# EAGLE design BiphasicBoard (EAGLE 6.5.0)
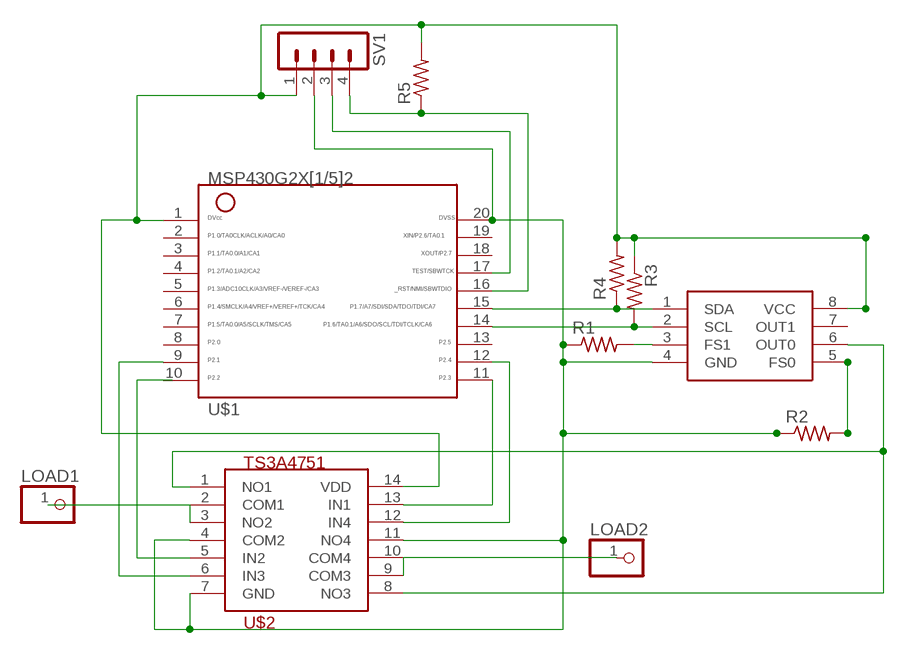
[diagram p0: schematic, sheet 1]

## Parts
LOAD1  PINHD-1X1  [1X01]
LOAD2  PINHD-1X1  [1X01]
R1  R-US_R0603  [R0603]
R2  R-US_R0603  [R0603]
R3  R-US_R0603  [R0603]
R4  R-US_R0603  [R0603]
R5  R-US_R0603  [R0603]
SV1  MA04-1  [MA04-1]
U$1  G2X[1/5]2---PW20  [PW20]
U$2  TS3A4751  [TS3A4751#2]
U$3  DS4432U+  [DS4432U+]

## Nets
CURRENT0: U$2.1(NO1) U$2.8(NO3) U$3.6(OUT0)
GND: R1.1 R2.1 SV1.2 U$1.20 U$2.4(COM2) U$2.7(GND) U$2.11(NO4) U$3.4(GND)
N$1: R3.2 U$1.14 U$3.2(SCL)
N$2: R4.1 U$1.15 U$3.1(SDA)
N$3: R3.1 R4.2 R5.2 SV1.1 U$1.1 U$2.14(VDD) U$3.8(VCC)
N$4: U$1.10 U$2.5(IN2)
N$5: SV1.3 U$1.17
N$6: R5.1 SV1.4 U$1.16
N$8: R2.2 U$3.5(FS0)
N$9: U$1.9 U$2.6(IN3)
N$10: U$1.11 U$2.13(IN1)
N$11: U$1.12 U$2.12(IN4)
N$12: LOAD1.1 U$2.2(COM1) U$2.3(NO2)
N$13: LOAD2.1 U$2.9(COM3) U$2.10(COM4)
VIA1: R1.2 U$3.3(FS1)
Unconnected: U$1.2 U$1.3 U$1.4 U$1.5 U$1.6 U$1.7 U$1.8 U$1.13 U$1.18 U$1.19 U$3.7(OUT1)

## Library data of the parts
LOAD1 LOAD2 = pinhead:PINHD-1X1: PIN HEADER
R1-R5 = resistor:R-US_: RESISTOR, American symbol
SV1 = con-lstb:MA04-1: PIN HEADER; OC_FARNELL: unknown; OC_NEWARK: unknown
U$1 = TI_MSP430_v16:G2X[1/5]2---PW20: MSP430G2X[1/5]2 MSP430G2x52, MSP430G2x12 TSSOP (PW) 20 Pin Package http://focus.ti.com/docs/prod/folders/print/msp430g2452.html
U$2 = TS3A4751:TS3A4751: TS3A4751
U$3 = DS4432U+:DS4432U+: DS4432U+

## Board
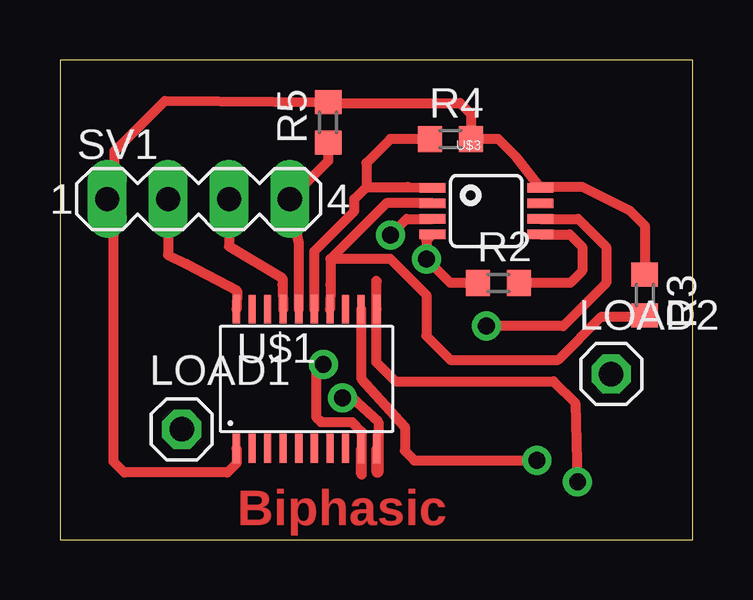
[diagram p1: board, top side]
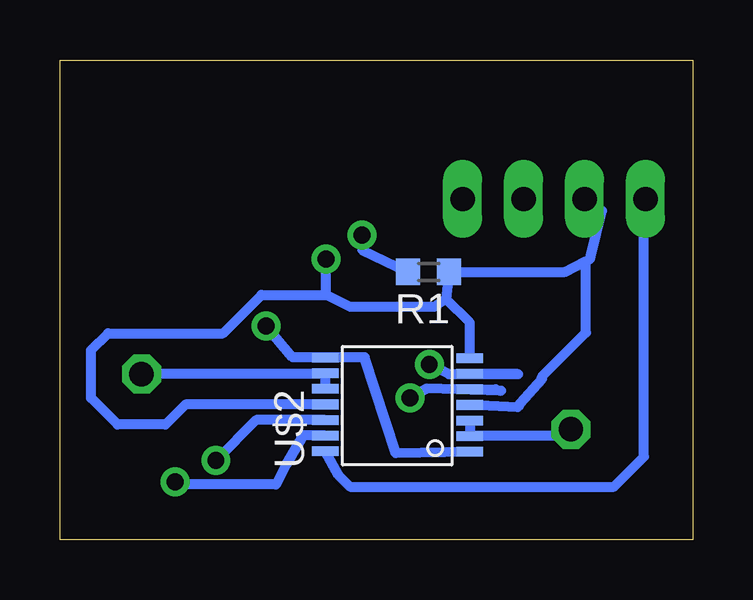
[diagram p2: board, bottom side, seen from below]

Size 26.38 x 20.01 mm. Coordinates in mm from the lower left corner, seen from the top.
Outline: 0,0 26.38,0 26.38,20.01 0,20.01 0,0
Copper layers (1*16): Top 0.035mm / dielectric 1.5mm / Bottom 0.035mm
Design rules "AdvancedCircuitsBarebones": minimum track width 6mil, minimum drill 20mil, track to track 6mil, track to pad 6mil, pad to pad 6mil, via to via 6mil, smd to smd 6mil, copper to edge 10mil, drill to drill 6mil, minimum pad ring 12mil, minimum via ring 10mil, stop-mask expansion 4mil, vias tented up to drill 25mil, thermal gap 10mil

### Footprints (pad centres in the part's own frame; a part is rotated, then mirrored left to right if it is on the bottom)
1X01 = drill 1.016 octagon: 1 0,0
R0603 = smd 1 x 1.1: 1 -0.85,0; 2 0.85,0
MA04-1 = drill 1.016 long: 1 -3.81,0; 2 -1.27,0; 3 1.27,0; 4 3.81,0
PW20 = smd 0.3 x 1.2: 1 -2.925,-2.9; 2 -2.275,-2.9; 3 -1.625,-2.9; 4 -0.975,-2.9; 5 -0.325,-2.9; 6 0.325,-2.9; 7 0.975,-2.9; 8 1.625,-2.9; 9 2.275,-2.9; 10 2.925,-2.9; 11 2.925,2.9; 12 2.275,2.9; 13 1.625,2.9; 14 0.975,2.9; 15 0.325,2.9; 16 -0.325,2.9; 17 -0.975,2.9; 18 -1.625,2.9; 19 -2.275,2.9; 20 -2.925,2.9
TS3A4751#2 = smd 0.4 x 1.1: 1 -2.435,-1.99; 2 -1.785,-1.99; 3 -1.135,-1.99; 4 -0.485,-1.99; 5 0.165,-1.99; 6 0.815,-1.99; 7 1.465,-1.99; 8 1.485,4.04; 9 0.835,4.04; 10 0.185,4.04; 11 -0.465,4.04; 12 -1.115,4.04; 13 -1.765,4.04; 14 -2.415,4.04
DS4432U+ = smd 1.1 x 0.4: 1 -2.25,0.975; 2 -2.25,0.325; 3 -2.25,-0.325; 4 -2.25,-0.975; 5 2.25,-0.975; 6 2.25,-0.325; 7 2.25,0.325; 8 2.25,0.975

### Placement (x,y rotation side)
LOAD1  5.08,4.61 0 top
LOAD2  22.98,6.91 0 top
R1  11.01,11.17 180 bottom
R2  18.28,10.71 0 top
R3  24.38,10.21 270 top
R4  16.28,16.71 0 top
R5  11.18,17.41 90 top
SV1  5.78,14.21 0 top
U$1  10.28,6.71 0 top
U$2  11.28,6.11 90 bottom
U$3  17.78,13.71 0 top

### Tracks (layer width: path | path; a pad name or v marks a point on that pad's centre or on a via)
CURRENT0  (via drill 0.7)
  Top 0.406: U$3.6 21.61,13.38 22.78,12.21 22.78,10.71 20.98,8.91 v17.78,8.91
  Bottom 0.406: U$2.1 12.38,3.61 13.68,7.61 U$2.8 16.68,7.61 v17.78,8.91
GND  (via drill 0.7)
  Top 0.406: SV1.2 4.51,11.88 5.28,11.51 7.38,10.38 U$1.20 | U$3.4 15.28,12.48 v15.28,11.71 16.28,10.71 R2.1
  Bottom 0.406: 4.45,11.62 5.32,11.17 R1.1 10.28,10.05 | 4.45,11.62 4.28,11.71 4.25,11.83 3.78,13.71 4.28,14.21 SV1.2 | 10.28,10.05 10.78,9.71 14.28,9.71 15.28,10.21 | 15.28,10.21 v15.28,11.71 | 4.45,11.62 4.45,8.64 6.28,6.81 6.28,6.71 7.18,5.71 7.3,5.52 U$2.4 | U$2.11 21.14,5.65 21.98,4.81 23.98,4.81 25.08,5.91 25.08,7.91 24.38,8.61 19.58,8.61 17.98,10.21 15.28,10.21 | U$2.7 9.29,9.06 10.28,10.05
N$1
  Top 0.406: U$3.2 13.61,14.04 11.28,11.71 | 11.28,11.71 11.28,10.63 U$1.14 | 11.28,11.71 13.78,11.71 15.28,10.21 15.28,8.51 16.28,7.51 20.78,7.51 22.58,9.31 24.33,9.31 R3.2
N$2
  Top 0.406: U$1.15 10.61,12.04 12.28,13.71 12.28,14.21 12.78,14.71 | 12.78,14.71 14.5,14.71 U$3.1 | R4.1 13.78,16.71 12.78,15.71 12.78,14.71
N$3
  Top 0.406: U$1.1 7.36,3.19 6.98,2.81 2.68,2.81 2.23,3.26 2.23,13.95 SV1.1 2.28,14.52 2.28,16.21 4.38,18.31 R5.2 11.23,18.21 16.68,18.21 17.13,17.76 R4.2 18.28,16.71 19.03,15.96 U$3.8 20.06,14.71 21.78,14.71 23.78,13.71 24.38,13.11 R3.1
  Bottom 0.406: U$2.14 14.78,2.71 14.28,2.21 3.28,2.21 2.03,3.46 2.03,14.15 SV1.1
N$4  (via drill 0.7)
  Top 0.406: v11.78,5.91 12.18,5.91 13.28,4.91 13.28,2.81 13.2,2.81 U$1.10
  Bottom 0.406: U$2.5 8.22,6.27 7.98,6.21 11.08,6.31 v11.78,5.91
N$5
  Top 0.406: SV1.3 7.05,12.24 9.28,10.91 9.28,10.63 U$1.17
N$6
  Top 0.406: U$1.16 9.95,12.38 9.59,14.02 SV1.4 11.18,15.8 R5.1
N$8
  Top 0.406: U$3.5 21.25,12.73 21.78,12.21 21.78,11.21 21.28,10.71 R2.2
N$9  (via drill 0.7)
  Top 0.406: v10.98,7.31 10.68,7.11 10.68,5.11 10.88,4.91 12.18,4.91 12.58,4.51 12.58,2.71 12.56,2.73 U$1.9
  Bottom 0.406: v10.98,7.31 10.18,6.91 7.28,6.91 8.16,6.93 U$2.6
N$10  (via drill 0.7)
  Top 0.406: U$1.11 13.2,10.79 13.18,10.81 13.18,7.41 13.98,6.61 20.58,6.61 21.48,5.71 v21.58,2.41
  Bottom 0.406: U$2.13 16.25,4.34 16.95,3.15 17.38,2.31 21.48,2.31 v21.58,2.41
N$11  (via drill 0.7)
  Top 0.406: U$1.12 12.56,6.73 14.38,4.71 14.38,3.71 14.78,3.31 v19.88,3.31
  Bottom 0.406: U$2.12 18.2,4.99 v19.88,3.31
N$12
  Bottom 0.406: 9.28,4.41 9.29,4.42 U$2.3 U$2.2 5.37,4.33 LOAD1.1
N$13
  Bottom 0.406: U$2.10 U$2.9 15.36,6.91 LOAD2.1
VIA1  (via drill 0.7)
  Top 0.406: v13.78,12.71 14.45,13.38 U$3.3
  Bottom 0.406: v13.78,12.71 13.78,12.09 R1.2

### Text on the board
Top: Biphasic